# Altium schematic sheet SynchrBuckConverter.SchDoc: Плата преобразования
size 840 x 594 mm; DrawnBy: Подлесный; SheetNumber: 1; Title1str: питания; DocumentType: Схема электрическая принципиальная; Format: A1
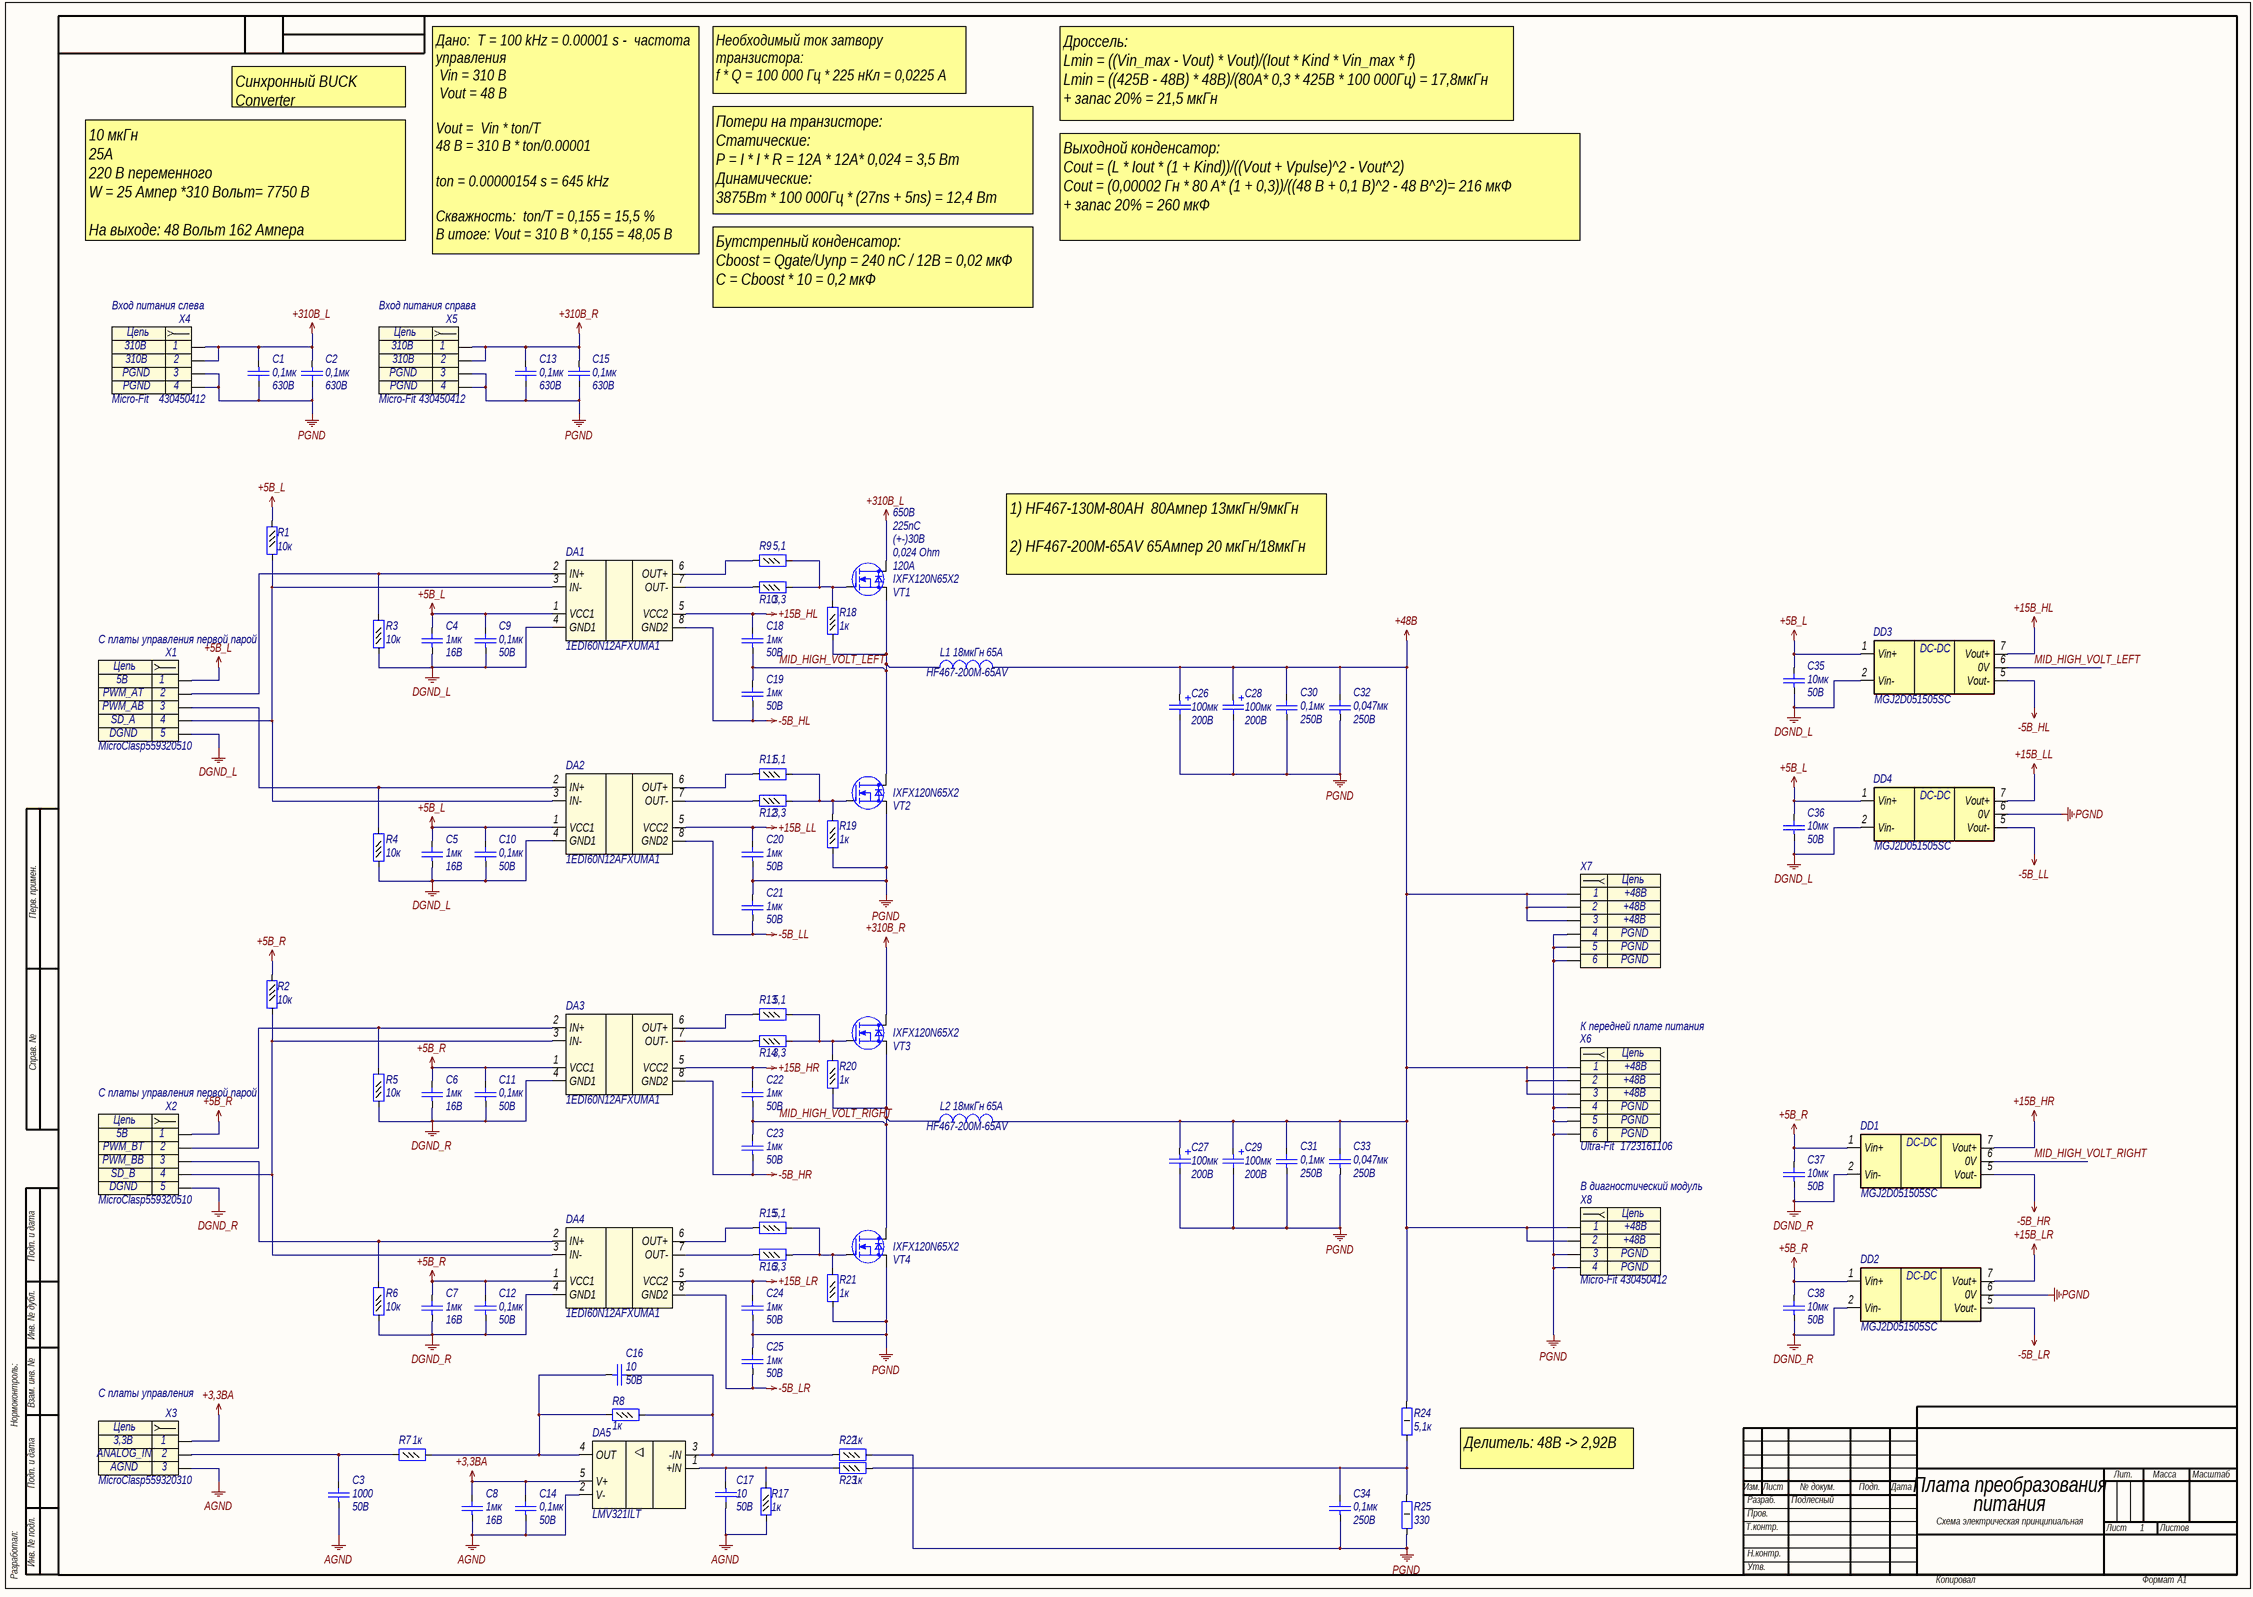
[diagram p0: SynchrBuckConverter.SchDoc]

## Parts
C1  Voltage: 630В  [C1812]  (hidden comment: 0,1мк)
C2  Voltage: 630В  [C1812]  (hidden comment: 0,1мк)
C3  value 1000  Voltage: 50B  [C0402]  (hidden comment: Capacitor)
C4  Voltage: 16B  [C0603]  (hidden comment: 1мк)
C5  Voltage: 16B  [C0603]  (hidden comment: 1мк)
C6  Voltage: 16B  [C0603]  (hidden comment: 1мк)
C7  Voltage: 16B  [C0603]  (hidden comment: 1мк)
C8  Voltage: 16B  [C0603]  (hidden comment: 1мк)
C9  Voltage: 50В  [C0402]  (hidden comment: 0,1мк)
C10  Voltage: 50В  [C0402]  (hidden comment: 0,1мк)
C11  Voltage: 50В  [C0402]  (hidden comment: 0,1мк)
C12  Voltage: 50В  [C0402]  (hidden comment: 0,1мк)
C13  Voltage: 630В  [C1812]  (hidden comment: 0,1мк)
C14  value 0,1мк  Voltage: 50В  [C0402]  (hidden comment: Capacitor)
C15  Voltage: 630В  [C1812]  (hidden comment: 0,1мк)
C16  value 10  Voltage: 50B  [C0402]  (hidden comment: Capacitor)
C17  value 10  Voltage: 50B  [C0402]  (hidden comment: Capacitor)
C18  Voltage: 50B  [C0805]  (hidden comment: 1мк)
C19  Voltage: 50B  [C0805]  (hidden comment: 1мк)
C20  Voltage: 50B  [C0805]  (hidden comment: 1мк)
C21  Voltage: 50B  [C0805]  (hidden comment: 1мк)
C22  Voltage: 50B  [C0805]  (hidden comment: 1мк)
C23  Voltage: 50B  [C0805]  (hidden comment: 1мк)
C24  Voltage: 50B  [C0805]  (hidden comment: 1мк)
C25  Voltage: 50B  [C0805]  (hidden comment: 1мк)
C26  value 100мк  Voltage: 200В  [Cap_SMD_radial_polar(18x21.5)]  (hidden comment: Capacitor_pol)
C27  value 100мк  Voltage: 200В  [Cap_SMD_radial_polar(18x21.5)]  (hidden comment: Capacitor_pol)
C28  value 100мк  Voltage: 200В  [Cap_SMD_radial_polar(18x21.5)]  (hidden comment: Capacitor_pol)
C29  value 100мк  Voltage: 200В  [Cap_SMD_radial_polar(18x21.5)]  (hidden comment: Capacitor_pol)
C30  Voltage: 250В  [C1206]  (hidden comment: 0,1мк)
C31  Voltage: 250В  [C1206]  (hidden comment: 0,1мк)
C32  Voltage: 250В  [C1206]  (hidden comment: 0,047мк)
C33  Voltage: 250В  [C1206]  (hidden comment: 0,047мк)
C34  Voltage: 250В  [C1206]  (hidden comment: 0,1мк)
C35  Voltage: 50В  [C1210]  (hidden comment: 10мк)
C36  Voltage: 50В  [C1210]  (hidden comment: 10мк)
C37  Voltage: 50В  [C1210]  (hidden comment: 10мк)
C38  Voltage: 50В  [C1210]  (hidden comment: 10мк)
DA1  Part Number: 1EDI60N12AFXUMA1  [PG-DSO-8]  (hidden comment: 1EDI60N12AF)
DA2  Part Number: 1EDI60N12AFXUMA1  [PG-DSO-8]  (hidden comment: 1EDI60N12AF)
DA3  Part Number: 1EDI60N12AFXUMA1  [PG-DSO-8]  (hidden comment: 1EDI60N12AF)
DA4  Part Number: 1EDI60N12AFXUMA1  [PG-DSO-8]  (hidden comment: 1EDI60N12AF)
DA5  LMV321ILT  [SOT23-5]
DD1  Part Number: MGJ2D051505SC  [SIP7]  (hidden comment: MGJ2DXX XXXX S C-RXX)
DD2  Part Number: MGJ2D051505SC  [SIP7]  (hidden comment: MGJ2DXX XXXX S C-RXX)
DD3  Part Number: MGJ2D051505SC  [SIP7]  (hidden comment: MGJ2DXX XXXX S C-RXX)
DD4  Part Number: MGJ2D051505SC  [SIP7]  (hidden comment: MGJ2DXX XXXX S C-RXX)
L1  value 18мкГн  Rated Current: 65A  [HF467-200M-65AV]  (hidden comment: Inductor)
L2  value 18мкГн  Rated Current: 65A  [HF467-200M-65AV]  (hidden comment: Inductor)
R1  value 10к  [R0402]  (hidden comment: Resistor_0,062Вт)
R2  value 10к  [R0402]  (hidden comment: Resistor_0,062Вт)
R3  value 10к  [R0402]  (hidden comment: Resistor_0,062Вт)
R4  value 10к  [R0402]  (hidden comment: Resistor_0,062Вт)
R5  value 10к  [R0402]  (hidden comment: Resistor_0,062Вт)
R6  value 10к  [R0402]  (hidden comment: Resistor_0,062Вт)
R7  value 1к  [R0402]  (hidden comment: Resistor_0,062Вт)
R8  value 1к  [R0402]  (hidden comment: Resistor_0,062Вт)
R9  value 5,1  [R0603]  (hidden comment: Resistor_0,062Вт)
R10  value 3,3  [R0603]  (hidden comment: Resistor_0,062Вт)
R11  value 5,1  [R0603]  (hidden comment: Resistor_0,062Вт)
R12  value 3,3  [R0603]  (hidden comment: Resistor_0,062Вт)
R13  value 5,1  [R0603]  (hidden comment: Resistor_0,062Вт)
R14  value 3,3  [R0603]  (hidden comment: Resistor_0,062Вт)
R15  value 5,1  [R0603]  (hidden comment: Resistor_0,062Вт)
R16  value 3,3  [R0603]  (hidden comment: Resistor_0,062Вт)
R17  value 1к  [R0402]  (hidden comment: Resistor_0,062Вт)
R18  value 1к  [R0603]  (hidden comment: Resistor_0,062Вт)
R19  value 1к  [R0603]  (hidden comment: Resistor_0,062Вт)
R20  value 1к  [R0603]  (hidden comment: Resistor_0,062Вт)
R21  value 1к  [R0603]  (hidden comment: Resistor_0,062Вт)
R22  value 1к  [R0402]  (hidden comment: Resistor_0,062Вт)
R23  value 1к  [R0402]  (hidden comment: Resistor_0,062Вт)
R24  value 5,1к  [R2512]  (hidden comment: Resistor_1Вт)
R25  value 330  [R2512]  (hidden comment: Resistor_1Вт)
VT1  V drain-source max: 650B  Rds: 0,024 Ohm  Gate-to-source voltage: (+-)30B  Continuous drain current: 120A  Total gate charge: 225nC  Part Number: IXFX120N65X2  [TO-247_V]  (hidden comment: N-MOSFET)
VT2  Part Number: IXFX120N65X2  [TO-247_V]  (hidden comment: N-MOSFET)
VT3  Part Number: IXFX120N65X2  [TO-247_V]  (hidden comment: N-MOSFET)
VT4  Part Number: IXFX120N65X2  [TO-247_V]  (hidden comment: N-MOSFET)
X1  C платы управления первой парой  Part Name: MicroClasp  Part Number: 559320510  [MOLEX_559320510]
X2  C платы управления первой парой  Part Name: MicroClasp  Part Number: 559320510  [MOLEX_559320510]
X3  C платы управления  Part Name: MicroClasp  Part Number: 559320310  [MOLEX_559320310]
X4  Вход питания слева  Part Name: Micro-Fit  Part Number: 430450412  [MOLEX_430450412]
X5  Вход питания справа  Part Name: Micro-Fit  Part Number: 430450412  [MOLEX_430450412]
X6  К передней плате питания  Part Name: Ultra-Fit  Part Number: 1723161106  [MOLEX_1723161106]
X7  Header_6_sct  [MOLEX_1722981106_HOLE]  (value not drawn)
X8  В диагностический модуль  Part Name: Micro-Fit  Part Number: 430450412  [MOLEX_430450412]

## Nets
+3,3BA: C8.2 C14.2 DA5.5(V+) X3.1
+5B_L: C4.2 C5.2 C9.2 C10.2 C35.2 C36.2 DA1.1(VCC1) DA2.1(VCC1) DD3.1(Vin+) DD4.1(Vin+) R1.1 X1.1
+5B_R: C6.2 C7.2 C11.2 C12.2 C37.2 C38.2 DA3.1(VCC1) DA4.1(VCC1) DD1.1(Vin+) DD2.1(Vin+) R2.1 X2.1
+15B_HR: C22.2 DA3.5(VCC2) DD1.7(Vout+)
+15B_LL: C20.2 DA2.5(VCC2) DD4.7(Vout+)
+15B_LR: C24.2 DA4.5(VCC2) DD2.7(Vout+)
+15B_НL: C18.2 DA1.5(VCC2) DD3.7(Vout+)
+48B: C26.1 C27.1 C28.1 C29.1 C30.2 C31.2 C32.2 C33.2 L1.2 L2.2 R24.2 X6.1 X6.2 X6.3 X7.1 X7.2 X7.3 X8.1 X8.2
+310B_L: C1.1 C2.1 VT1.2(D) X4.1 X4.2
+310B_R: C13.1 C15.1 VT3.2(D) X5.1 X5.2
-5B_HL: C19.1 DA1.8(GND2) DD3.5(Vout-)
-5B_HR: C23.1 DA3.8(GND2) DD1.5(Vout-)
-5B_LL: C21.1 DA2.8(GND2) DD4.5(Vout-)
-5B_LR: C25.1 DA4.8(GND2) DD2.5(Vout-)
AGND: C3.1 C8.1 C14.1 C17.2 DA5.2(V-) R17.1 X3.3
DGND_L: C4.1 C5.1 C9.1 C10.1 C35.1 C36.1 DA1.4(GND1) DA2.4(GND1) DD3.2(Vin-) DD4.2(Vin-) R3.1 R4.1 X1.5
DGND_R: C6.1 C7.1 C11.1 C12.1 C37.1 C38.1 DA3.4(GND1) DA4.4(GND1) DD1.2(Vin-) DD2.2(Vin-) R5.1 R6.1 X2.5
PGND: C1.2 C2.2 C13.2 C15.2 C20.1 C21.2 C24.1 C25.2 C26.2 C27.2 C28.2 C29.2 C30.1 C31.1 C32.1 C33.1 C34.1 DD2.6(0V) DD4.6(0V) R19.1 R21.1 R22.2 R25.1 VT2.3(S) VT4.3(S) X4.3 X4.4 X5.3 X5.4 X6.4 X6.5 X6.6 X7.4 X7.5 X7.6 X8.3 X8.4
MID_HIGH_VOLT_LEFT: C18.1 C19.2 DD3.6(0V) L1.1 R18.1 VT1.3(S) VT2.2(D)
MID_HIGH_VOLT_RIGHT: C22.1 C23.2 DD1.6(0V) L2.1 R20.1 VT3.3(S) VT4.2(D)
NetC3_2: C3.2 R7.1 X3.2
NetC16_1: C16.1 DA5.4(OUT) R7.2 R8.1
NetC16_2: C16.2 DA5.3(-IN) R8.2 R22.1
NetC17_1: C17.1 DA5.1(+IN) R17.2 R23.1
NetC34_2: C34.2 R23.2 R24.1 R25.2
NetDA1_2: DA1.2(IN+) R3.2 X1.2
NetDA1_3: DA1.3(IN-) DA2.3(IN-) R1.2 X1.4
NetDA1_6: DA1.6(OUT+) R9.1
NetDA1_7: DA1.7(OUT-) R10.1
NetDA2_2: DA2.2(IN+) R4.2 X1.3
NetDA2_6: DA2.6(OUT+) R11.1
NetDA2_7: DA2.7(OUT-) R12.1
NetDA3_2: DA3.2(IN+) R5.2 X2.2
NetDA3_3: DA3.3(IN-) DA4.3(IN-) R2.2 X2.4
NetDA3_6: DA3.6(OUT+) R13.1
NetDA3_7: DA3.7(OUT-) R14.1
NetDA4_2: DA4.2(IN+) R6.2 X2.3
NetDA4_6: DA4.6(OUT+) R15.1
NetDA4_7: DA4.7(OUT-) R16.1
NetR9_2: R9.2 R10.2 R18.2 VT1.1(G)
NetR11_2: R11.2 R12.2 R19.2 VT2.1(G)
NetR13_2: R13.2 R14.2 R20.2 VT3.1(G)
NetR15_2: R15.2 R16.2 R21.2 VT4.1(G)

## Notes on the sheet
- Синхронный BUCK Converter
- Необходимый ток затвору транзистора:
  f * Q = 100 000 Гц * 225 нКл = 0,0225 А
  Ток на затвор = 15В / 5,1 ом = 3А
- Дроссель:
  Lmin = ((Vin_max - Vout) * Vout)/(Iout * Kind * Vin_max * f)
  Lmin = ((425B - 48B) * 48B)/(80A* 0,3 * 425B * 100 000Гц) = 17,8мкГн
  + запас 20% = 21,5 мкГн
- Потери на транзисторе:
  Cтатические:
  P = I * I * R = 12A * 12A* 0,024 = 3,5 Вт
  Динамические:
  3875Вт * 100 000Гц * (27ns + 5ns) = 12,4 Вт
- 10 мкГн
  25А
  220 В переменного
  W = 25 Ампер *310 Вольт= 7750 В
  На выходе: 48 Вольт 162 Ампера
- Выходной конденсатор:
  Сout = (L * Iout * (1 + Kind))/((Vout + Vpulse)^2 - Vout^2)
  Сout = (0,00002 Гн * 80 А* (1 + 0,3))/((48 В + 0,1 В)^2 - 48 В^2)= 216 мкФ
  + запас 20% = 260 мкФ
- Дано: 	T = 100 kHz = 0.00001 s - 	частота управления
  Vin = 310 B
  Vout = 48 B
  Vout =  Vin * ton/T
  48 B = 310 B * ton/0.00001
  ton = 0.00000154 s = 645 kHz
  Скважность:  ton/T = 0,155 = 15,5 %
  В итоге: Vout = 310 В * 0,155 = 48,05 В
- Бутстрепный конденсатор:
  Сboost = Qgate/Uупр = 240 nC / 12B = 0,02 мкФ
  С = Сboost * 10 = 0,2 мкФ
- 1) HF467-130M-80AH  80Ампер 13мкГн/9мкГн
  2) HF467-200M-65AV 65Ампер 20 мкГн/18мкГн
- Перв. примен.
- Справ. №
- Подп. и дата
- Инв. № дубл.
- Нормоконтроль:
- Взам. инв. №
- Делитель: 48В -> 2,92В
- Изм.
- Лист
- № докум.
- Подп.
- Дата
- Лит.
- Масса
- Масштаб
- Т.контр.
- Пров.
- Разраб.
- Листов
- Разработал:
- Инв. № подл.
- Н.контр.
- Утв.
- Копировал
- Формат
- (in symbol connect96) Цепь
- (in symbol connect98) Цепь
- (in symbol connect114) Цепь
- (in symbol connect137) Цепь
- (in symbol connect199) Цепь
- (in symbol pwr144) DC-DC

## Library data of the parts
C1 C2 C13 C15 = cap237: Конденсатор; Part Name: Ceramic; Manufacture: Murata; Part Number: GRM43DR72J104KW01L; id: cap237; TKE: X7R; Value: 0,1мк
C3 = cap28: Конденсатор; Part Name: Ceramic; Manufacture: Murata; Part Number: GRM1555C1H102J; id: cap28; TKE: NP0
C4-C8 = cap133: Конденсатор; Part Name: Ceramic; Manufacture: Murata; Part Number: GRM188R71C105KA12D**; id: cap133; TKE: X7R; Value: 1мк
C9-C12 C14 = cap277: Конденсатор; Part Name: Ceramic; Manufacture: Murata; Part Number: GRM155R71H104KE14D; id: cap277; TKE: X7R; tga: 0,10%
  C9-C12: Value: 0,1мк
C16 C17 = cap5: Конденсатор; Part Name: Ceramic; Manufacture: Murata; Part Number: GRM1535C1H100J; id: cap5; TKE: NP0
C18-C25 = cap151: Конденсатор; Part Name: Ceramic; Manufacture: Murata; Part Number: GRM21BR71H105K; id: cap151; TKE: X7R; Value: 1мк
C26-C29 = cap325: Конденсатор полярный; Part Name: Electrolit; Manufacture: Panasonic; Part Number: EEV-EB2D101M; id: cap325; tga: 0,20%
C30 C31 C34 = cap179: Конденсатор; Part Name: Ceramic; Manufacture: Murata; Part Number: GRM31CR72E104K; id: cap179; TKE: X7R; Value: 0,1мк
C32 C33 = cap177: Конденсатор; Part Name: Ceramic; Manufacture: Murata; Part Number: GRM31CR72E473K; id: cap177; TKE: X7R; Value: 0,047мк
C35-C38 = cap297: Конденсатор; Part Name: MLCC; Manufacture: TDK; Part Number: C3225X7R1H106K250AC; id: cap297; TKE: X7R; tga: 0,10%; Value: 10мк
DA1-DA4 = driver33: Single Channel MOSFET Gate Driver IC; Manufacture: Infineon Technologies; Min Operating Supply Voltage: 3B; Max Operating Supply Voltage: 17B; Maximum output current: 6А; Maximum Power Dissipation: 400 mW; id: driver33; Part Name: Single Channel MOSFET Gate Driver IC
DA5 = amp10: HIGH-DRIVE OPERATIONAL AMPLIFIERS WITH SHUTDOWN; Part Name: Micropower / Operational Amplifiers; Manufacture: ST Microelectronics; id: amp10; Rail-to-rail: yes; Supply Voltage: 2,7-6B; Supply Current max: 200uA; Bandwidth: 1MHz; Input Bias Current: 10nA; CMRR: 85dB; PSRR: 80dB; Offset voltage: 0,1mB; Channels: 1; Part Number: LMV321ILT
DD1-DD4 = pwr144: DC/DC преобразователь; Part Name: Isolated 2W Gate Drive DC-DC Converters; Manufacturer: Murata Power Solutions; id: pwr144; Input Voltage: 5B; Output Voltage: 15B/-5В; Current: 80mA/40mA; Power output: 2W; Type: Isolated
L1 L2 = ind218: EMI Suppression Filter; Part Name: Сustom Inductor 18uH 80Amps; Manufacture: Coil Winding Specialis; id: ind218; Part Number: HF467-200M-65AV
R1-R6 = res294: Резистор; Manufacture: Yageo; Part Number: RC0402FR-0710KL; id: res294; Accuracy: 0,01; Part Name: Resistor; Power: 0,062Вт
R7 R8 R17 R22 R23 = res270: Резистор; Manufacture: Yageo; Part Number: RC0402FR-071KL; id: res270; Accuracy: 0,01; Part Name: Resistor; Power: 0,062Вт
R9 R11 R13 R15 = res408: Резистор; Manufacture: Yageo; Part Number: RC0603FR-075R1L; id: res408; Accuracy: 0,01; Part Name: Resistor; Power: 0,062Вт
R10 R12 R14 R16 = res403: Резистор; Manufacture: Yageo; Part Number: RC0603FR-073R3L; id: res403; Accuracy: 0,01; Part Name: Resistor; Power: 0,062Вт
R18-R21 = res463: Резистор; Manufacture: Yageo; Part Number: RC0603FR-071KL; id: res463; Accuracy: 0,01; Part Name: Resistor; Power: 0,062Вт
R24 = res867: Резистор; Manufacture: Yageo; Part Number: RC2512FR-075K1; id: res867; Accuracy: 0,01; Power: 1Вт; Part Name: Resistor
R25 = res838: Резистор; Manufacture: Yageo; Part Number: RC2512FR-07330RL; id: res838; Accuracy: 0,01; Power: 1Вт; Part Name: Resistor
VT1 = mosfert30: Manufacturer: IXYS; Structure: n-channel; Pulsed drain current: 480A; Power dissipation: 1250W; id: mosfert30
VT2-VT4 = mosfert30: Manufacturer: IXYS; Structure: n-channel; V drain-source max: 650B; Rds: 0,024 Ohm; Gate-to-source voltage: (+-)30B; Continuous drain current: 120A; Total gate charge: 225nC; Pulsed drain current: 480A; Power dissipation: 1250W; id: mosfert30
X1 = connect98: Разъем - 5 конт. розетка; Manufacture: Molex; Contact_1: 5В; Contact_2: PWM_AT; Contact_3: PWM_AB; Contact_4: SD_A; Contact_5: DGND; Etch: 2mm; id: connect98
X2 = connect98: Разъем - 5 конт. розетка; Manufacture: Molex; Contact_1: 5В; Contact_2: PWM_BT; Contact_3: PWM_BB; Contact_4: SD_B; Contact_5: DGND; Etch: 2mm; id: connect98
X3 = connect96: Разъем - 3 конт. розетка; Manufacture: Molex; Contact_1: 3,3В; Contact_2: ANALOG_IN; Contact_3: AGND; Etch: 2mm; id: connect96
X4 X5 = connect114: Разъем - 4 конт. розетка; Manufacture: Molex; Contact_1: 310B; Contact_3: PGND; Etch: 3mm; Contact_2: 310B; Contact_4: PGND; id: connect114
X6 = connect137: Разъем - 6 конт. розетка; Manufacture: Molex; Contact_1: +48B; Contact_4: PGND; Etch: 3.5mm; Contact_2: +48B; Contact_3: +48B; Contact_5: PGND; Contact_6: PGND; id: connect137
X7 = connect199: Разъем - 6 конт. розетка; Part Name: Ultra-Fit Vertical HOLE; Part Number: 1722981106; Manufacture: Molex; Contact_1: +48B; Contact_4: PGND; Etch: 3.5mm; Contact_2: +48B; Contact_3: +48B; Contact_5: PGND; Contact_6: PGND; id: connect199
X8 = connect114: Разъем - 4 конт. розетка; Manufacture: Molex; Contact_1: +48B; Contact_3: PGND; Etch: 3mm; Contact_2: +48B; Contact_4: PGND; id: connect114